# EAGLE design DELA-EPROMMER_II_27512_Extension_Rev1 (EAGLE 9.7.0)
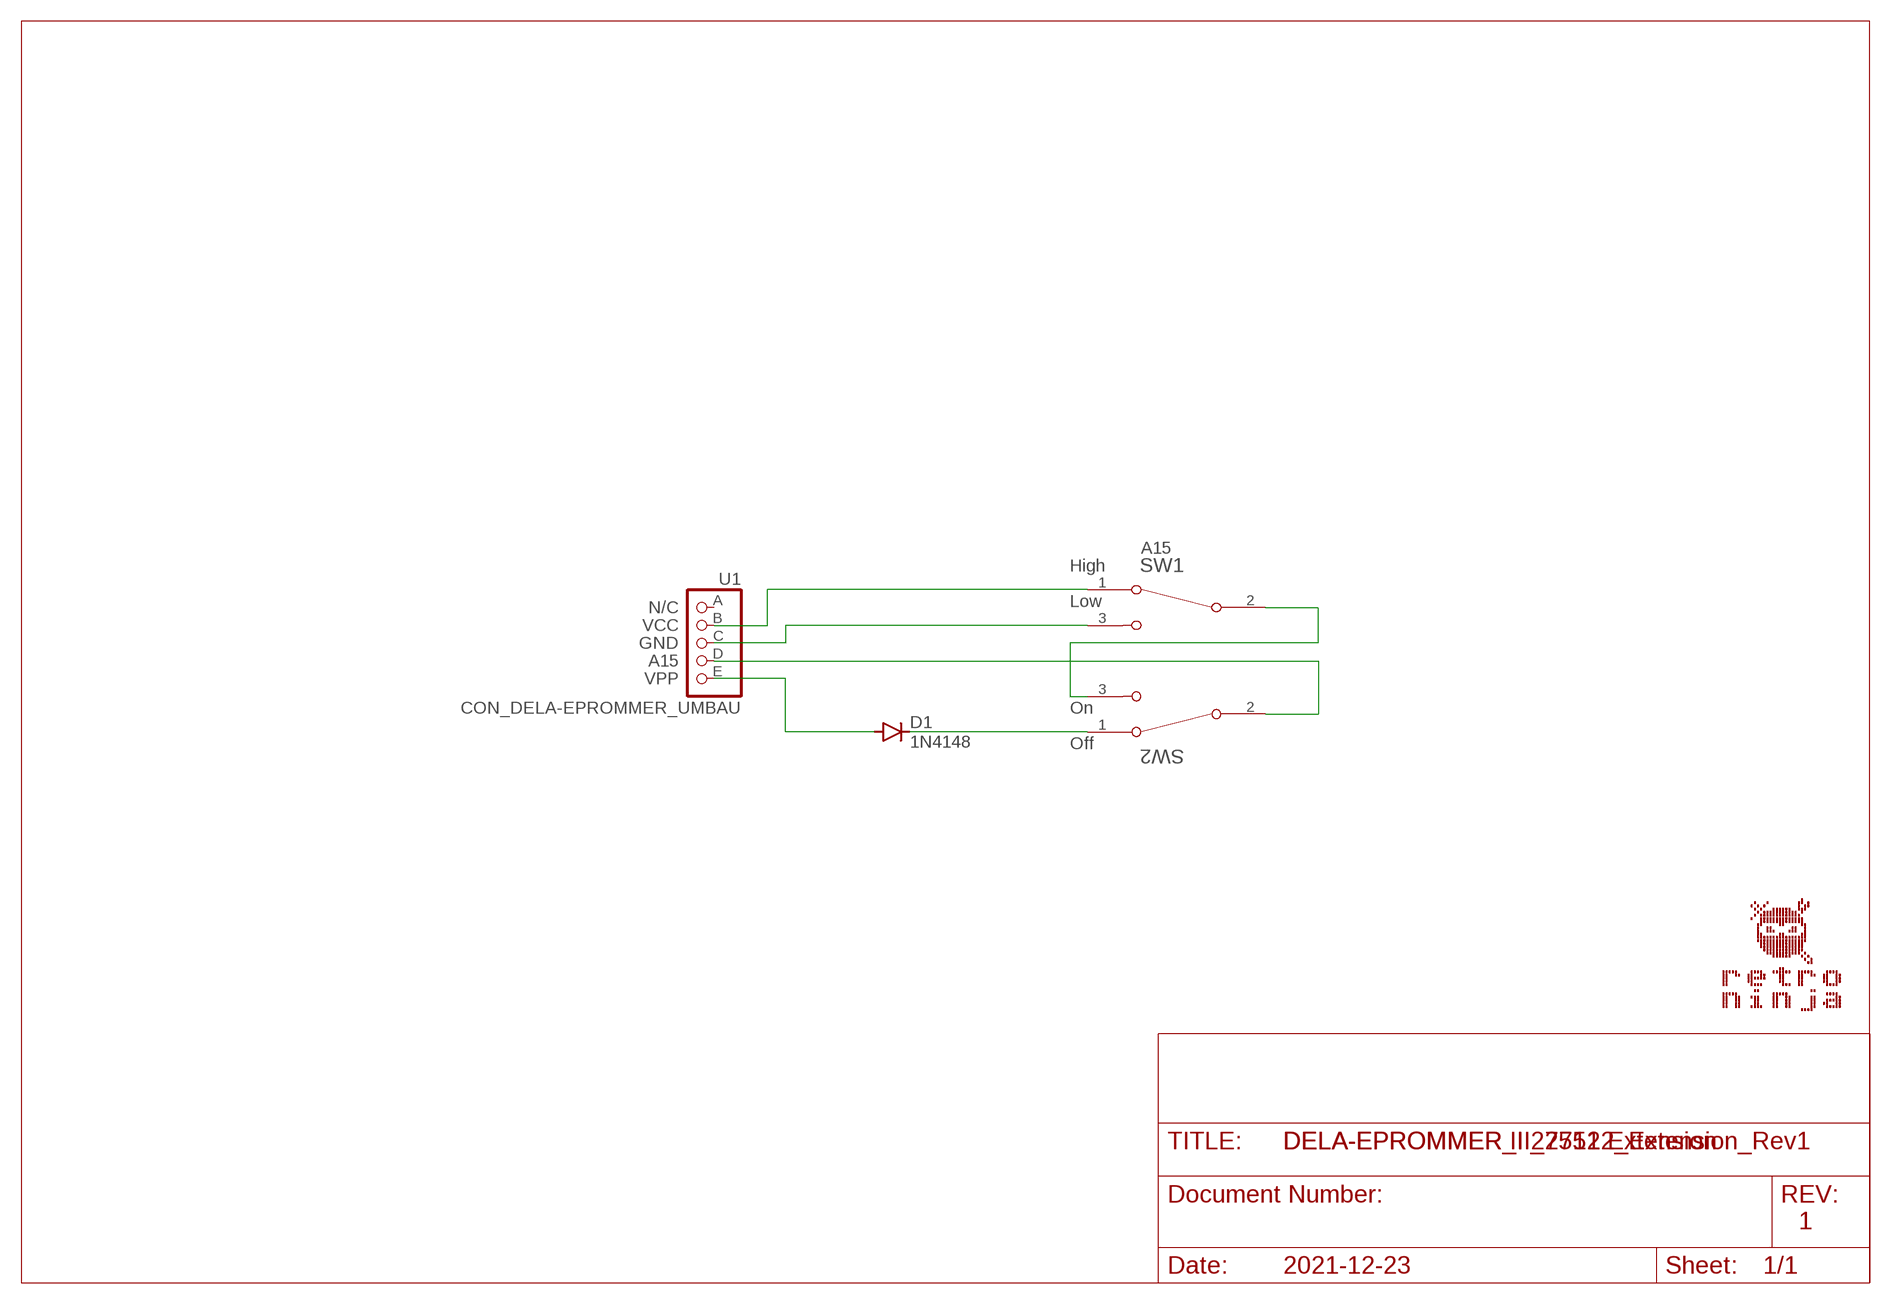
[diagram p0: schematic, sheet 1]

## Parts
D1  1N4148  DIODE_DO35-10  [DO35-10]
SW1  SWITCH_SLIDE_2POS_2MM  [SWITCH_SLIDE_2POS_2MM]
SW2  SWITCH_SLIDE_2POS_2MM  [SWITCH_SLIDE_2POS_2MM]
U1  CON_DELA-EPROMMER_UMBAU  [CON_DELA-EPROMMER_UMBAU]

## Nets
N$1: SW1.1 U1.B
N$2: SW1.3 U1.C
N$3: SW2.2 U1.D
N$4: SW1.2 SW2.3
N$5: D1.C SW2.1
N$6: D1.A U1.E
Unconnected: U1.A

## Notes on the sheet
- A15
- High
- N/C | Low
- VCC
- GND
- A15
- VPP
- On
- Off
- DELA-EPROMMER II 27512 Extension
- 1
- 2021-12-23

## Library data of the parts
D1 = Per (Fusion 360):DIODE
SW1 SW2 = Per (Fusion 360):SWITCH_SLIDE_2POS_2MM
U1 = Per (Fusion 360):CON_DELA-EPROMMER_UMBAU

## Board
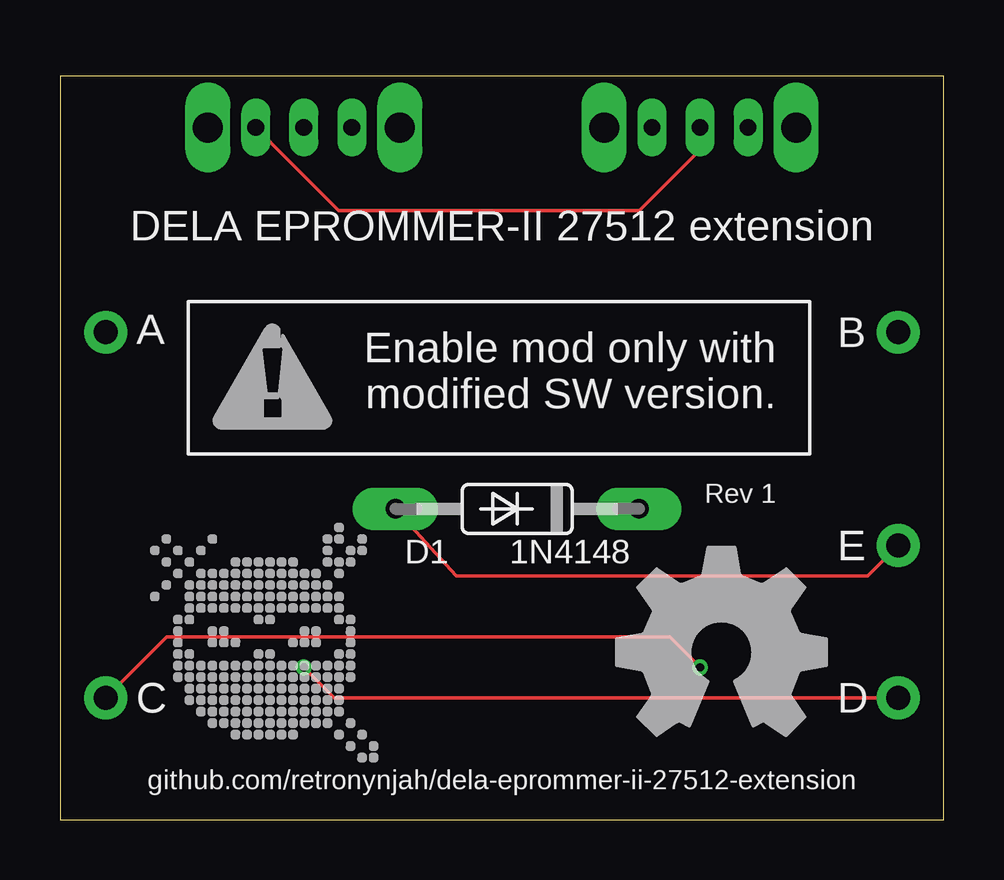
[diagram p1: board, top side]
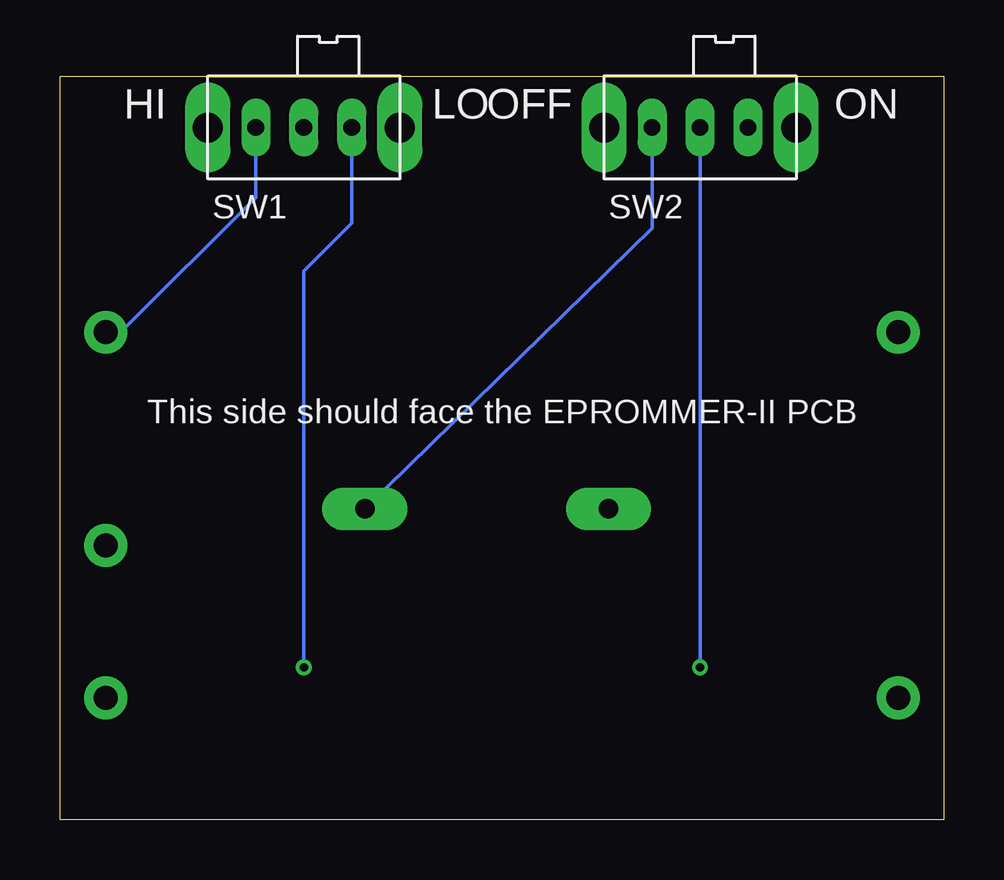
[diagram p2: board, bottom side, seen from below]

Size 36.83 x 30.99 mm. Coordinates in mm from the lower left corner, seen from the top.
Outline: 0,0 36.83,0 36.83,30.99 0,30.99 0,0
Copper layers (1*16): Top 0.035mm / dielectric 1.5mm / Bottom 0.035mm
Design rules "SeeedStudio_2layer_DRU_no_angle_20140221": minimum track width 6mil, minimum drill 12mil, track to track 6mil, track to pad 6mil, pad to pad 6mil, via to via 6mil, smd to smd 0mil, copper to edge 10mil, drill to drill 10mil, minimum pad ring 10mil, minimum via ring 6mil, stop-mask expansion 2mil, vias tented up to drill 100mil, thermal gap 10mil

### Footprints (pad centres in the part's own frame; a part is rotated, then mirrored left to right if it is on the bottom)
DO35-10 = drill 0.813 pad 1.778 long: A 3.81,-2.54; C -6.35,-2.54
SWITCH_SLIDE_2POS_2MM = drill 0.7 long: 1 -2,0; 2 0,0; 3 2,0 | drill 1.25 long: ANCHOR1 -4,0; ANCHOR2 4,0
CON_DELA-EPROMMER_UMBAU = drill 1 pad 1.778: A -16.51,7.62; B 16.51,7.62; C -16.51,-7.62; D 16.51,-7.62; E 16.51,-1.27

### Placement (x,y rotation side)
D1  17.78,10.41 180 top
SW1  26.67,28.86 0 bottom
SW2  10.16,28.86 0 bottom
U1  18.41,12.7 0 top
U$1  [WARNING_5MM]  6.35,16.26 0 top
U$2  [RETRONINJA_NOTEXT_10MM]  8.51,7.62 0 top
U$3  [OSHW_NOTEXT_8MM]  23.11,3.43 0 top

### Tracks (layer width: path | path; a pad name or v marks a point on that pad's centre or on a via)
N$1
  Bottom 0.152: SW1.1 28.67,25.94 34.29,20.32 U1.B
N$2  (via drill 0.35)
  Top 0.152: v26.67,6.35 25.4,7.62 4.45,7.62 U1.C
  Bottom 0.152: SW1.3 24.67,24.86 26.67,22.86 v26.67,6.35
N$3  (via drill 0.35)
  Top 0.152: U1.D 11.43,5.08 v10.16,6.35
  Bottom 0.152: SW2.2 v10.16,6.35
N$4
  Top 0.152: SW1.2 26.67,27.94 24.13,25.4 11.62,25.4 SW2.3
N$5
  Bottom 0.152: SW2.1 12.16,24.67 D1.C
N$6
  Top 0.152: U1.E 33.66,10.16 16.51,10.16 D1.A

### Text on the board
tPlace: DELA EPROMMER-II 27512 extension | Enable mod only with / modified SW version. | Rev 1 | github.com/retronynjah/dela-eprommer-ii-27512-extension
bPlace: ON | OFF | LO | HI | This side should face the EPROMMER-II PCB